# Altium schematic sheet shared_header.SchDoc
size Tabloid
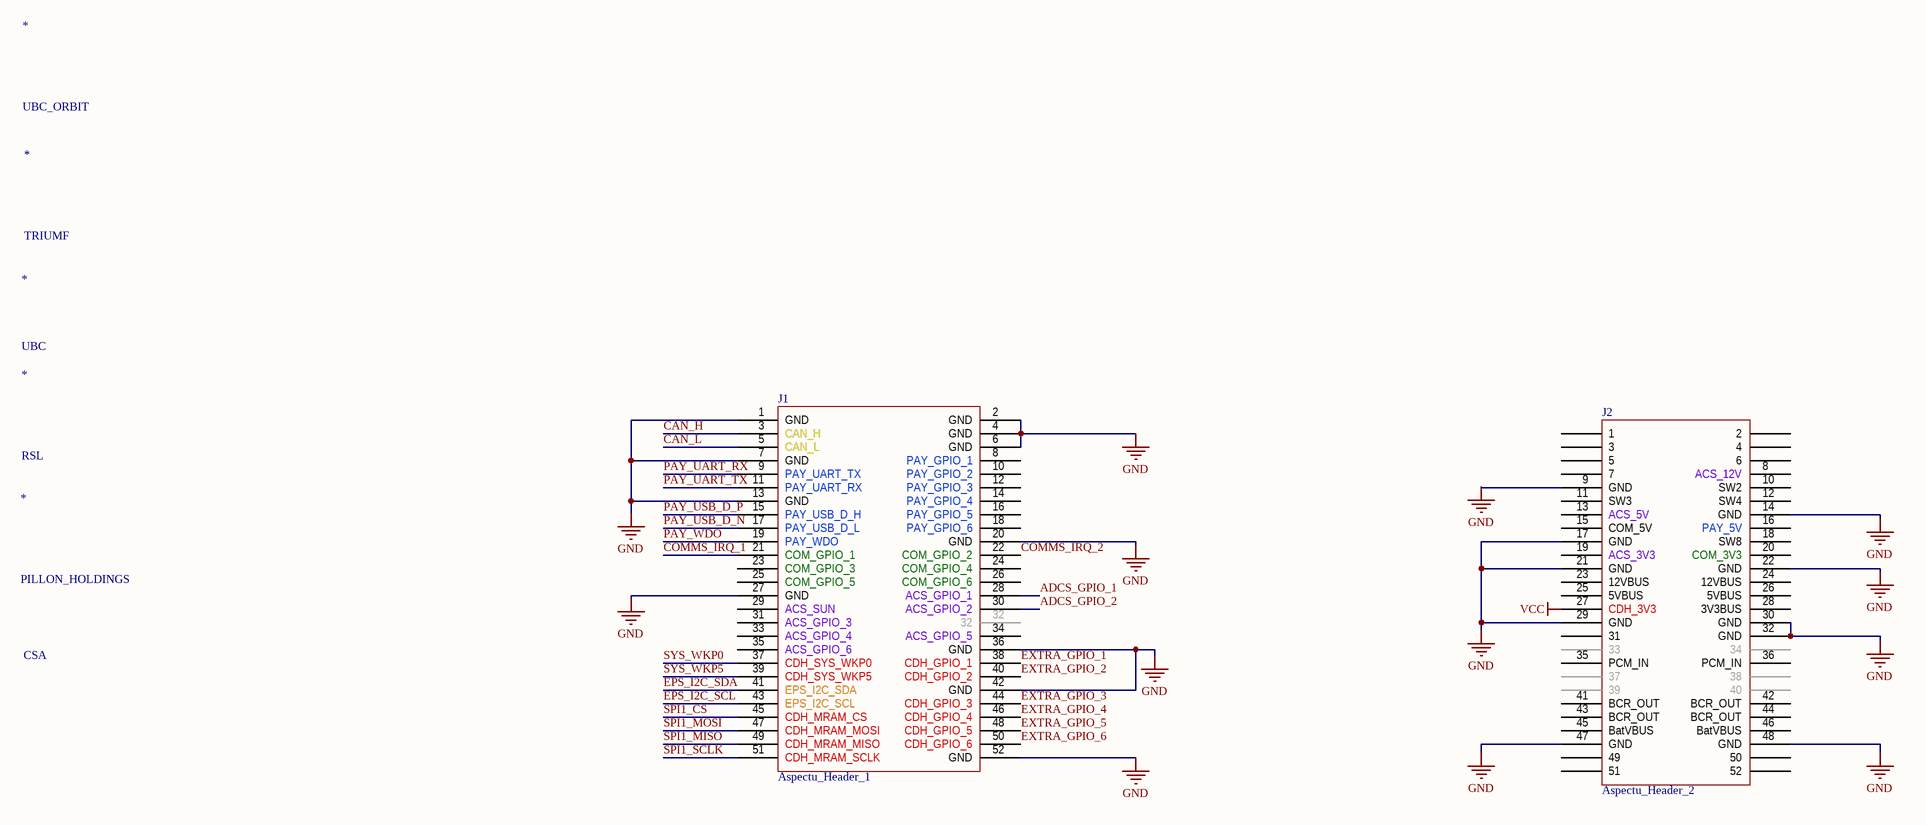
[diagram p0: shared_header.SchDoc]

## Parts
(Parts that share a designator on the sheet are numbered #1, #2 ... from top to bottom, then left to right.)
*#1  UBC_ORBIT  [UBC_ORBIT]
*#2  TRIUMF  [TRIUMF]
*#3  UBC  [UBC]
*#4  RSL  [RSL]
*#5  PILLON_HOLDINGS  [PILLON_HOLDINGS]
?  CSA  [CSA]
J1  Aspectu_Header_1  [Aspectu_Header_1]
J2  Aspectu_Header_2  [Aspectu_Header_2]

## Nets
GND: J1.1(GND) J1.2(GND) J1.4(GND) J1.6(GND) J1.7(GND) J1.13(GND) J1.20(GND) J1.27(GND) J1.36(GND) J1.42(GND) J1.52(GND) J2.9(GND) J2.14(GND) J2.17(GND) J2.21(GND) J2.22(GND) J2.29(GND) J2.30(GND) J2.32(GND) J2.47(GND) J2.48(GND)
VCC: J2.27(CDH_3V3)
ADCS_GPIO_1: J1.28(ACS_GPIO_1)
ADCS_GPIO_2: J1.30(ACS_GPIO_2)
CAN_H: J1.3(CAN_H)
CAN_L: J1.5(CAN_L)
COMMS_IRQ_1: J1.21(COM_GPIO_1)
COMMS_IRQ_2: J1.22(COM_GPIO_2)
EPS_I2C_SCL: J1.43(EPS_I2C_SCL)
EPS_I2C_SDA: J1.41(EPS_I2C_SDA)
EXTRA_GPIO_1: J1.38(CDH_GPIO_1)
EXTRA_GPIO_2: J1.40(CDH_GPIO_2)
EXTRA_GPIO_3: J1.44(CDH_GPIO_3)
EXTRA_GPIO_4: J1.46(CDH_GPIO_4)
EXTRA_GPIO_5: J1.48(CDH_GPIO_5)
EXTRA_GPIO_6: J1.50(CDH_GPIO_6)
PAY_UART_RX: J1.9(PAY_UART_TX)
PAY_UART_TX: J1.11(PAY_UART_RX)
PAY_USB_D_N: J1.17(PAY_USB_D_L)
PAY_USB_D_P: J1.15(PAY_USB_D_H)
PAY_WDO: J1.19(PAY_WDO)
SPI1_CS: J1.45(CDH_MRAM_CS)
SPI1_MISO: J1.49(CDH_MRAM_MISO)
SPI1_MOSI: J1.47(CDH_MRAM_MOSI)
SPI1_SCLK: J1.51(CDH_MRAM_SCLK)
SYS_WKP0: J1.37(CDH_SYS_WKP0)
SYS_WKP5: J1.39(CDH_SYS_WKP5)

Not connected (* = marked no-connect by the designer): J1 8(PAY_GPIO_1) 10(PAY_GPIO_2) 12(PAY_GPIO_3) 14(PAY_GPIO_4) 16(PAY_GPIO_5) 18(PAY_GPIO_6) 23(COM_GPIO_3) 24(COM_GPIO_4) 25(COM_GPIO_5) 26(COM_GPIO_6) 29(ACS_SUN) 31(ACS_GPIO_3) 32 33(ACS_GPIO_4) 34(ACS_GPIO_5) 35(ACS_GPIO_6); J2 1 2 3 4 5 6 7 8(ACS_12V) 10(SW2) 11(SW3) 12(SW4) 13(ACS_5V) 15(COM_5V) 16(PAY_5V) 18(SW8) 19(ACS_3V3) 20(COM_3V3) 23(12VBUS) 24(12VBUS) 25(5VBUS) 26(5VBUS) 28(3V3BUS) 31 33 34 35(PCM_IN) 36(PCM_IN) 37 38 39 40 41(BCR_OUT) 42(BCR_OUT) 43(BCR_OUT) 44(BCR_OUT) 45(BatVBUS) 46(BatVBUS) 49 50 51 52

## Library data of the parts
*#1 = 3: UBC Orbit Logo; OrbitPartId: 3
*#2 = 8: TRIUMF Logo; OrbitPartId: 8
*#3 = 5: UBC Logo; OrbitPartId: 5
*#4 = 6: RSL Logo; OrbitPartId: 6
*#5 = 7: Pillon Holdings Logo; OrbitPartId: 7
? = 9: CSA Logo; OrbitPartId: 9
J1 = 1: Aspectu Header 1; OrbitPartId: 1; PartId: 1; Type: Connector; Subtype: Header
J2 = 2: Aspectu Header 2; OrbitPartId: 2; PartId: 2; Type: Connector; Subtype: Header